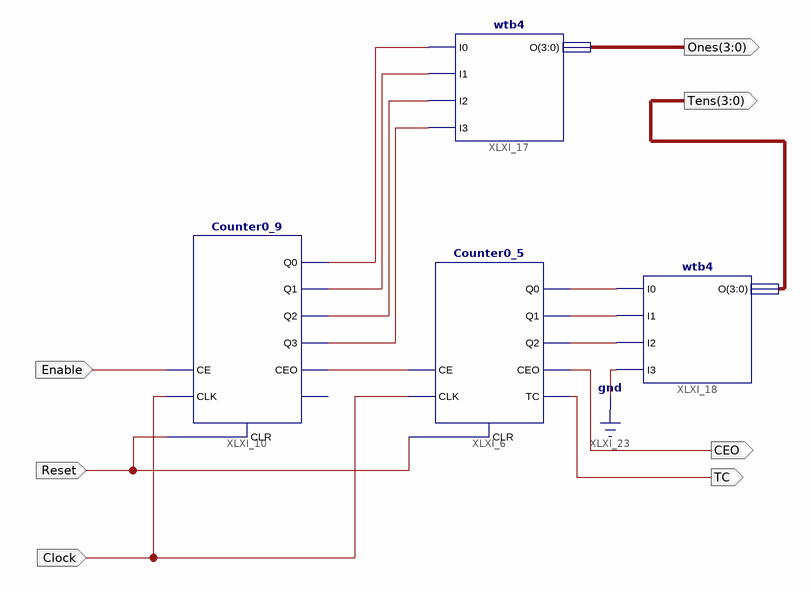
[diagram p0: schematic sheet 1]
// Xilinx ISE schematic Counter00_59.sch (spartan6) as structural Verilog: 4 symbols, 7 ports
module Counter00_59 (
  input  Reset,
  input  Clock,
  input  Enable,
  output [3:0] Ones,
  output [3:0] Tens,
  output CEO,
  output TC
);

  wire XLXN_28, XLXN_67, XLXN_68, XLXN_69, XLXN_70, XLXN_95, XLXN_96, XLXN_97;

  Counter0_5 XLXI_6 (
    .CE(XLXN_28), .CLK(Clock), .CLR(Reset), .CEO(CEO), .Q0(XLXN_95), .Q1(XLXN_96), .Q2(XLXN_97), .TC(TC));
  Counter0_9 XLXI_10 (
    .CE(Enable), .CLK(Clock), .CLR(Reset), .CEO(XLXN_28), .Q0(XLXN_67), .Q1(XLXN_68), .Q2(XLXN_69),
    .Q3(XLXN_70));  // open: TC
  wtb4 XLXI_17 (.I0(XLXN_67), .I1(XLXN_68), .I2(XLXN_69), .I3(XLXN_70), .O(Ones));
  wtb4 XLXI_18 (.I0(XLXN_95), .I1(XLXN_96), .I2(XLXN_97), .I3(1'b0), .O(Tens));
endmodule
